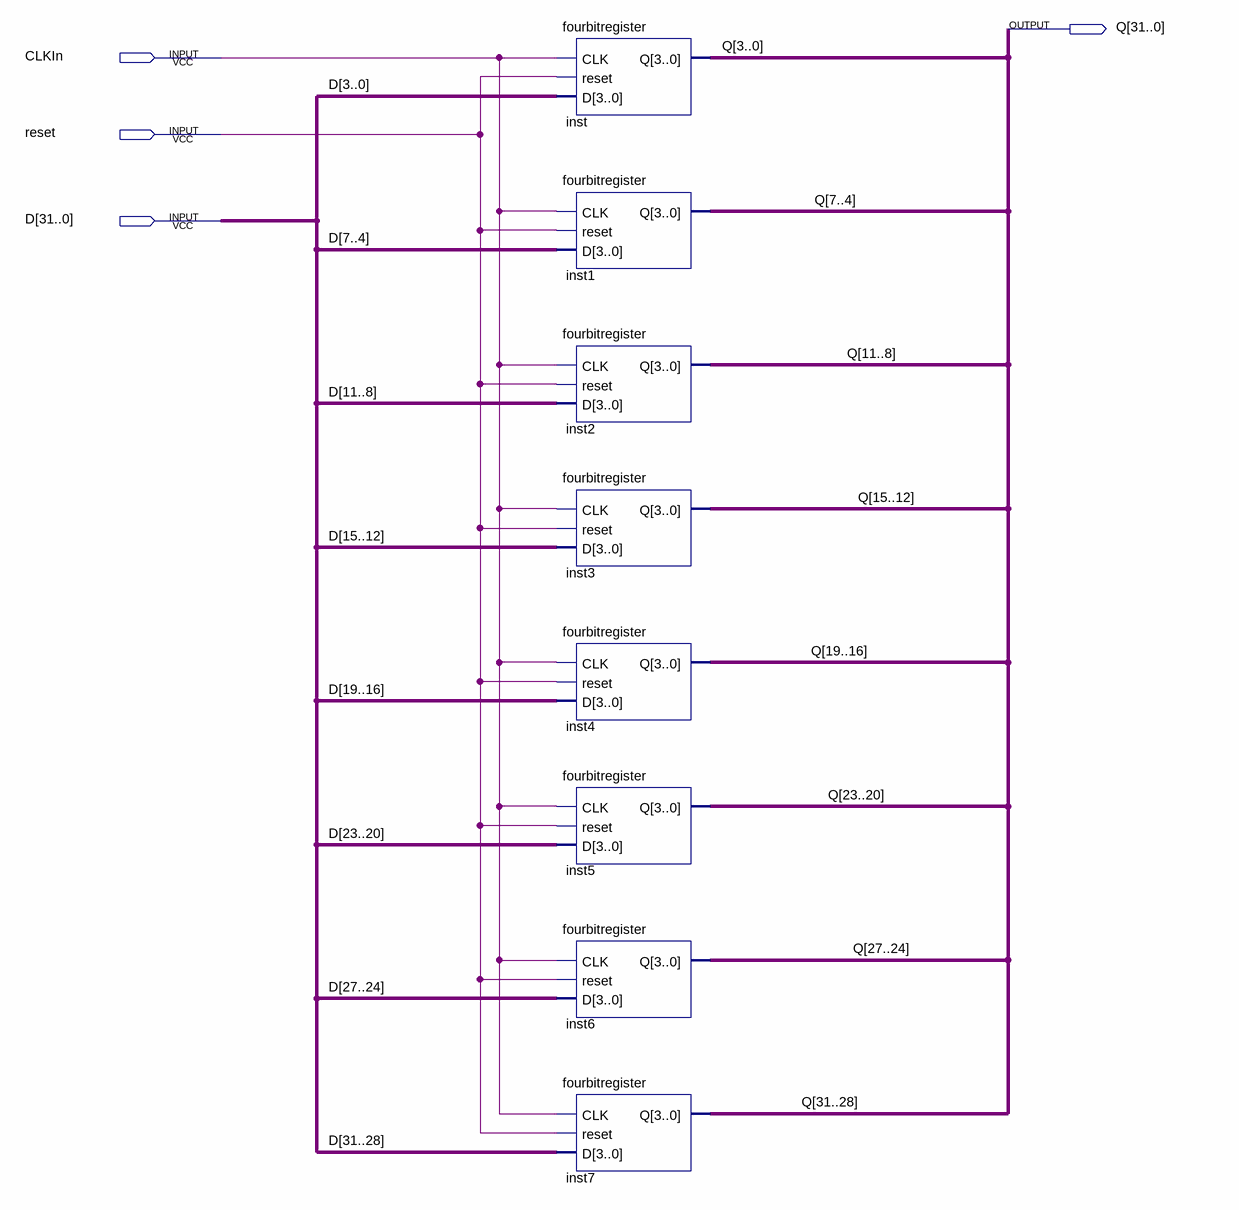
[diagram p0: schematic sheet]
// Quartus schematic thirtytworegister.bdf as structural Verilog: 8 symbols, 4 pins
module thirtytworegister (
  input  CLKIn,
  input  reset,
  input  [31:0] D,
  output [31:0] Q
);

  fourbitregister inst (.CLK(CLKIn), .reset(reset), .D(D[3:0]), .Q(Q[3:0]));
  fourbitregister inst1 (.CLK(CLKIn), .reset(reset), .D(D[7:4]), .Q(Q[7:4]));
  fourbitregister inst2 (.CLK(CLKIn), .reset(reset), .D(D[11:8]), .Q(Q[11:8]));
  fourbitregister inst3 (.CLK(CLKIn), .reset(reset), .D(D[15:12]), .Q(Q[15:12]));
  fourbitregister inst4 (.CLK(CLKIn), .reset(reset), .D(D[19:16]), .Q(Q[19:16]));
  fourbitregister inst5 (.CLK(CLKIn), .reset(reset), .D(D[23:20]), .Q(Q[23:20]));
  fourbitregister inst6 (.CLK(CLKIn), .reset(reset), .D(D[27:24]), .Q(Q[27:24]));
  fourbitregister inst7 (.CLK(CLKIn), .reset(reset), .D(D[31:28]), .Q(Q[31:28]));
endmodule
